# EAGLE design RAMBoSCadapter (EAGLE 6.2)
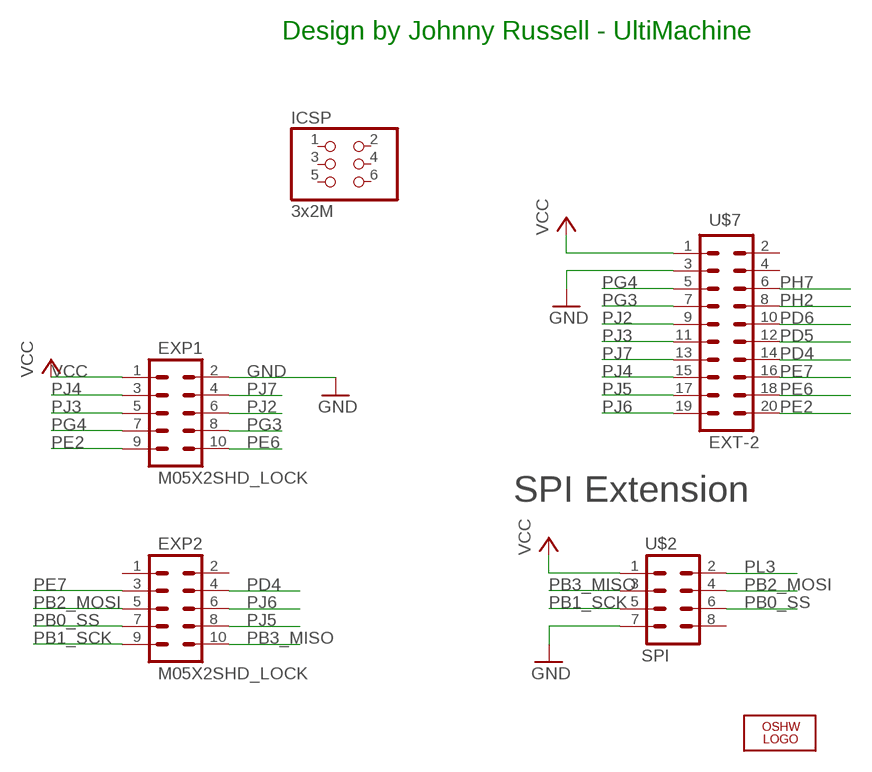
[diagram p0: schematic, sheet 1]

## Parts
EXP1  M05X2SHD_LOCK  [2X5-SHROUDED_LOCK]
EXP2  M05X2SHD_LOCK  [2X5-SHROUDED_LOCK]
ICSP  3x2M  PINHD-2X3  [2X03]
LOGO1  OSHW_LOGO_8MILX0150-NT  [OSHW_8X150_NOTEXT]
U$2  SPI  M04X2  [2X4]
U$7  EXT-2  M10X2  [2X10]

## Nets
GND [gnd]: EXP1.2 U$2.7 U$7.3
PB0_SS: EXP2.7 U$2.6
PB1_SCK: EXP2.9 U$2.5
PB2_MOSI: EXP2.5 U$2.4
PB3_MISO: EXP2.10 U$2.3
PD4: EXP2.4 U$7.14
PD5: U$7.12
PD6: U$7.10
PE2: EXP1.9 U$7.20
PE6: EXP1.10 U$7.18
PE7: EXP2.3 U$7.16
PG3: EXP1.8 U$7.7
PG4: EXP1.7 U$7.5
PH2: U$7.8
PH7: U$7.6
PJ2: EXP1.6 U$7.9
PJ3: EXP1.5 U$7.11
PJ4: EXP1.3 U$7.15
PJ5: EXP2.8 U$7.17
PJ6: EXP2.6 U$7.19
PJ7: EXP1.4 U$7.13
PL3: U$2.2
VCC: EXP1.1 U$2.1 U$7.1
Unconnected: EXP2.1 EXP2.2 ICSP.1 ICSP.2 ICSP.3 ICSP.4 ICSP.5 ICSP.6 U$2.8 U$7.2 U$7.4

## Notes on the sheet
- Design by Johnny Russell - UltiMachine
- SPI Extension

## Library data of the parts
EXP1 EXP2 = SparkFun:M05X2: Header 5x2 Standard 10-pin dual row 0.1" header. Commonly used with AVR-ISP. Use with Spark Fun Electronics SKU: PRT-00778
ICSP = SmartPrj:PINHD-2X3: PIN HEADER
LOGO1 = ohw-logo:OSHW_LOGO_8MIL
U$2 = SparkFun:M04X2
U$7 = SparkFun:M10X2: This was SPECIALLY designed to be used with our Graphic LCD Backpack. Be sure you want to use this! It is not only staggered on each line of header holes, but IT IS ALSO offset of the center point of the top and bottom lines by 5 mil. This causes the headers to lock into place on the "standard" footprint on the LCD screen. The extra squares on the tdocu layer are there simply to reference other pins (if you were to actually populate a longer header than ten long - this is what we do with the backpacks).

## Net classes
0 default: width 0.178 mm, drill 0.381 mm, clearance 0.178 mm
1 power: width 0.203 mm, drill 0.381 mm, clearance 0.178 mm
2 gnd: width 0.203 mm, drill 0.381 mm, clearance 0.178 mm
3 power usb: width 0.203 mm, drill 0.381 mm, clearance 0.178 mm

## Board
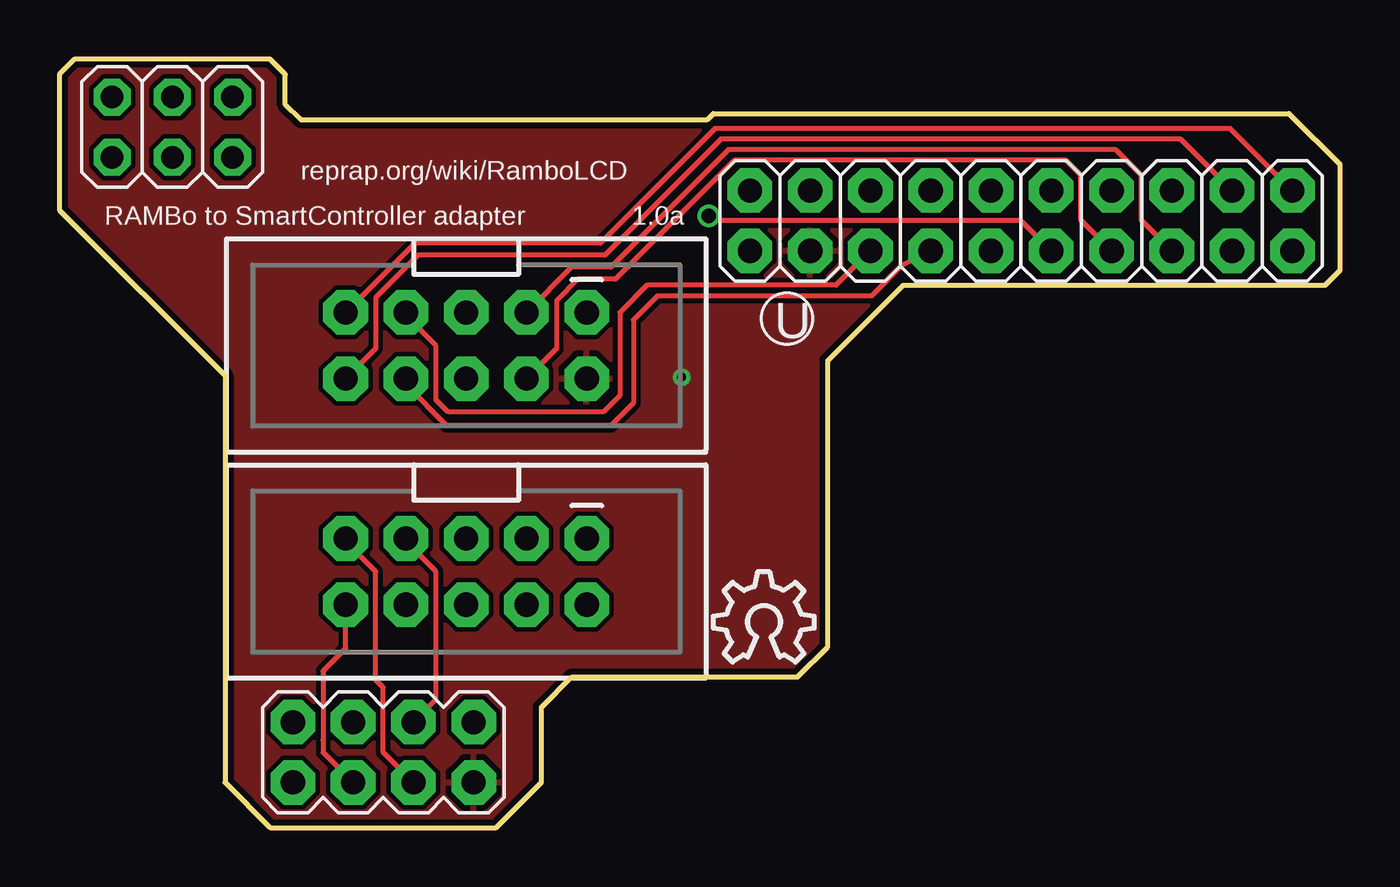
[diagram p1: board, top side]
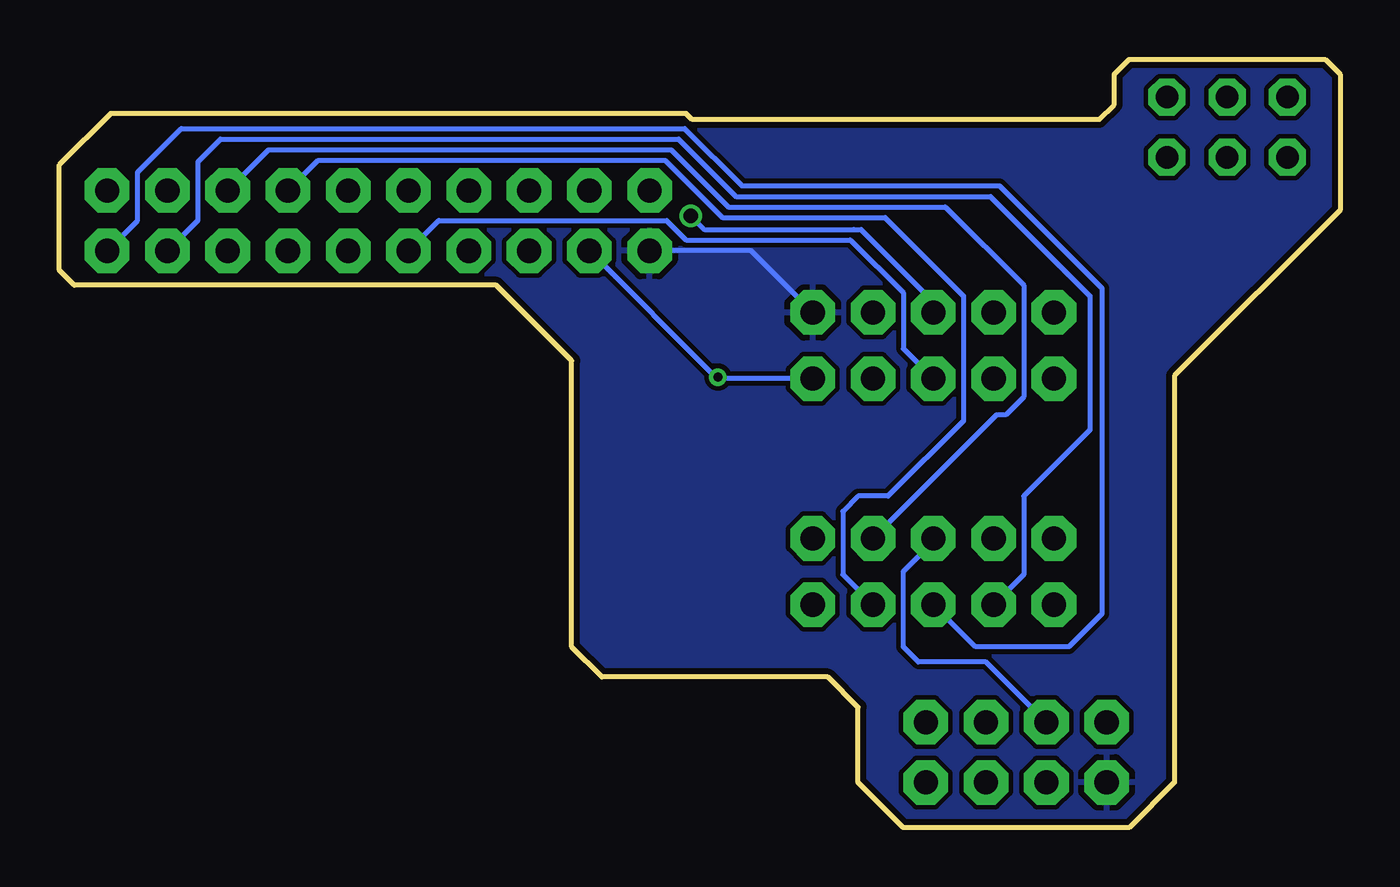
[diagram p2: board, bottom side, seen from below]

Size 53.98 x 32.38 mm. Coordinates in mm from the lower left corner, seen from the top.
Outline: 20.32,1.91 20.32,5.08 21.59,6.35 31.11,6.35 32.38,7.62 32.38,19.68 35.56,22.86 53.34,22.86 53.98,23.5 53.98,27.94 51.82,30.1 27.56,30.1 27.3,29.84 10.16,29.84 9.53,30.48 9.53,31.75 8.89,32.38 0.64,32.38 0,31.75 0,26.04 6.99,19.05 6.99,1.91 8.89,0 18.41,0 20.32,1.91
Copper layers (1*16): Top 0.035mm / dielectric 1.5mm / Bottom 0.035mm
Design rules: minimum track width 7mil, minimum drill 15mil, track to track 8mil, track to pad 8mil, pad to pad 7mil, via to via 7mil, smd to smd 7mil, copper to edge 10mil, drill to drill 8mil, minimum pad ring 12mil, minimum via ring 7mil, stop-mask expansion 4mil, vias tented up to drill 25mil, thermal gap 10mil

### Footprints (pad centres in the part's own frame; a part is rotated, then mirrored left to right if it is on the bottom)
2X5-SHROUDED_LOCK = drill 1.016 pad 1.88 octagon: 1 -1.397,5.08; 2 1.397,5.08; 3 -1.397,2.54; 4 1.397,2.54; 5 -1.397,0; 6 1.397,0; 7 -1.397,-2.54; 8 1.397,-2.54; 9 -1.397,-5.08; 10 1.397,-5.08
2X03 = drill 0.95 pad 1.55 octagon: 1 -2.54,-1.27; 2 -2.54,1.27; 3 0,-1.27; 4 0,1.27; 5 2.54,-1.27; 6 2.54,1.27
2X4 = drill 1.016 pad 1.88 octagon: 1 -3.81,-1.27; 2 -3.81,1.27; 3 -1.27,-1.27; 4 -1.27,1.27; 5 1.27,-1.27; 6 1.27,1.27; 7 3.81,-1.27; 8 3.81,1.27
2X10 = drill 1.016 pad 1.88 octagon: 1 -11.43,-1.27; 2 -11.43,1.27; 3 -8.89,-1.27; 4 -8.89,1.27; 5 -6.35,-1.27; 6 -6.35,1.27; 7 -3.81,-1.27; 8 -3.81,1.27; 9 -1.27,-1.27; 10 -1.27,1.27; 11 1.27,-1.27; 12 1.27,1.27; 13 3.81,-1.27; 14 3.81,1.27; 15 6.35,-1.27; 16 6.35,1.27; 17 8.89,-1.27; 18 8.89,1.27; 19 11.43,-1.27; 20 11.43,1.27

### Placement (x,y rotation side)
EXP1  17.14,20.32 270 top
EXP2  17.14,10.79 270 top
ICSP  4.76,29.53 0 top
LOGO1  27.56,6.99 0 top
U$2  13.65,3.17 0 top
U$7  40.53,25.58 0 top

### Tracks (layer width: path | path; a pad name or v marks a point on that pad's centre or on a via)
GND  (via drill 0.38)
  Bottom 0.203: EXP1.2 26.25,18.92 | 26.25,18.92 U$7.3 | 26.25,18.92 26.25,18.96 v26.23,18.99
  pour Top: 0.64,32.38 8.89,32.38 9.53,31.75 9.53,30.48 10.16,29.84 27.3,29.84 27.56,30.1 51.82,30.1 53.98,27.94 53.98,23.5 53.34,22.86 35.56,22.86 32.38,19.68 32.38,7.62 31.11,6.35 21.59,6.35 20.32,5.08 20.32,1.91 18.41,0 8.89,0 6.99,1.91 6.99,19.05 0,26.04 0,31.75
PB0_SS
  Top 0.203: U$2.6 15.88,5.4 15.88,10.79 14.61,12.06 EXP2.7
PB1_SCK
  Top 0.203: U$2.5 13.65,3.17 13.65,5.91 13.34,6.22 13.34,10.79 12.06,12.06 EXP2.9
PB2_MOSI
  Bottom 0.203: U$2.4 14.92,6.99 17.78,6.99 18.41,7.62 18.41,10.79 17.14,12.06 EXP2.5
PB3_MISO
  Top 0.203: U$2.3 11.18,3.11 11.11,3.17 11.11,3.68 11.11,6.6 11.18,6.67 12.06,7.56 EXP2.10
PD4
  Bottom 0.203: U$7.14 43.06,28.13 28.45,28.13 26.04,25.72 19.18,25.72 15.88,22.42 15.88,17.14 19.05,13.97 20.32,13.97 20.95,13.34 20.95,10.67 EXP2.4 19.68,9.53
PE2
  Top 0.203: U$7.20 49.35,29.46 27.62,29.46 22.8,24.64 14.99,24.64 EXP1.9
PE6
  Top 0.203: EXP1.10 13.34,20.19 13.34,22.35 15.11,24.13 22.99,24.13 27.88,29.02 47.25,29.02 U$7.18
PE7
  Bottom 0.203: U$7.16 45.16,28.57 28.19,28.57 25.78,26.16 16.64,26.16 13.34,22.86 13.34,18.16 14.1,17.4 14.48,17.4 EXP2.3
PG3
  Top 0.203: U$7.7 35.5,23.69 34.23,22.42 25.21,22.42 24.19,21.4 24.19,17.91 23.24,16.95 16.32,16.95 14.61,18.67 EXP1.8
PG4
  Top 0.203: U$7.5 32.73,22.86 24.77,22.86 23.62,21.72 23.62,18.22 22.92,17.53 16.38,17.53 15.88,18.03 15.88,20.32 14.61,21.59 EXP1.7
PJ2
  Bottom 0.203: U$7.9 37.98,25.59 28.38,25.59 27.56,24.77 20.64,24.77 18.41,22.54 18.41,20.19 EXP1.6
PJ3  (via drill 0.6 pad 0.38)
  Top 0.203: U$7.11 40.52,25.59 38.99,25.59 27.75,25.59 27.56,25.59 v27.37,25.78
  Bottom 0.203: v27.37,25.78 26.8,25.21 20.51,25.21 20.19,25.21 17.27,22.29 17.27,21.84 EXP1.5
PJ4
  Top 0.203: U$7.15 45.59,25.6 45.59,27.5 44.51,28.57 28.19,28.57 23.24,23.62 21.59,23.62 EXP1.3
PJ5
  Bottom 0.203: U$7.17 48.13,25.6 48.13,28.07 47.18,29.02 27.88,29.02 25.46,26.61 14.73,26.61 10.54,22.42 10.54,16.76 13.34,13.97 13.34,10.67 EXP2.8
PJ6
  Bottom 0.203: U$7.19 50.67,25.59 50.67,27.62 48.83,29.46 27.62,29.46 25.21,27.05 14.35,27.05 10.03,22.73 10.03,9.02 11.43,7.62 15.37,7.62 EXP2.6
PJ7
  Top 0.203: U$7.13 43.05,25.6 43.05,27.5 42.42,28.13 28.45,28.13 23.43,23.11 21.84,23.11 20.95,22.23 20.95,20.19 EXP1.4
VCC
  Bottom 0.203: EXP1.1 24.82,24.31 U$7.1
  pour Bottom: 0.64,32.38 8.89,32.38 9.53,31.75 9.53,30.48 10.16,29.84 27.3,29.84 27.56,30.1 51.82,30.1 53.98,27.94 53.98,23.5 53.34,22.86 35.56,22.86 32.38,19.68 32.38,7.62 31.11,6.35 21.59,6.35 20.32,5.08 20.32,1.91 18.41,0 8.89,0 6.99,1.91 6.99,19.05 0,26.04 0,31.75

### Text on the board
_tsilk: reprap.org/wiki/RamboLCD | RAMBo to SmartController adapter | 1.0a | U